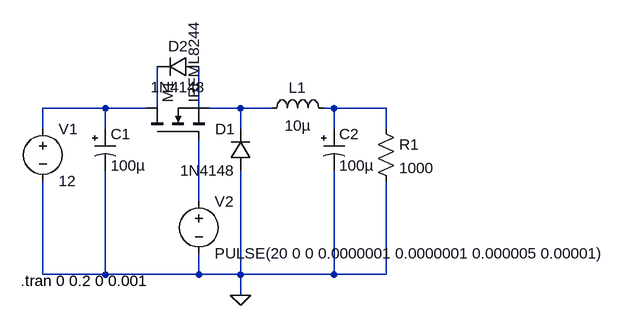
[diagram p0: schematic main.asc]
main.asc, the LTspice schematic file:
Version 4
SHEET 1 996 680
WIRE 96 96 0 96
WIRE 160 96 96 96
WIRE 176 96 176 32
WIRE 240 96 240 32
WIRE 304 96 256 96
WIRE 352 96 304 96
WIRE 448 96 432 96
WIRE 528 96 448 96
WIRE 0 128 0 96
WIRE 96 128 96 96
WIRE 304 128 304 96
WIRE 448 128 448 96
WIRE 528 128 528 96
WIRE 240 240 240 144
WIRE 0 352 0 208
WIRE 96 352 96 192
WIRE 96 352 0 352
WIRE 240 352 240 320
WIRE 240 352 96 352
WIRE 304 352 304 192
WIRE 304 352 240 352
WIRE 448 352 448 192
WIRE 448 352 304 352
WIRE 528 352 528 208
WIRE 528 352 448 352
WIRE 304 384 304 352
FLAG 304 384 0
SYMBOL voltage 0 112 R0
WINDOW 123 0 0 Left 2
WINDOW 39 0 0 Left 2
SYMATTR InstName V1
SYMATTR Value 12
SYMBOL voltage 240 224 R0
WINDOW 123 0 0 Left 2
WINDOW 39 0 0 Left 2
SYMATTR InstName V2
SYMATTR Value PULSE(20 0 0 0.0000001 0.0000001 0.000005 0.00001)
SYMBOL nmos 160 144 R270
SYMATTR InstName M1
SYMATTR Value IRFML8244
SYMBOL polcap 80 128 R0
WINDOW 3 24 56 Left 2
SYMATTR InstName C1
SYMATTR Value 100µ
SYMATTR Description Capacitor
SYMATTR Type cap
SYMATTR SpiceLine V=10 Irms=110m Rser=1.8 Lser=0
SYMBOL polcap 432 128 R0
WINDOW 3 24 56 Left 2
SYMATTR InstName C2
SYMATTR Value 100µ
SYMATTR Description Capacitor
SYMATTR Type cap
SYMATTR SpiceLine V=25 Irms=145m Rser=0.62 Lser=0
SYMBOL diode 320 192 R180
WINDOW 0 24 64 Left 2
WINDOW 3 24 0 Left 2
SYMATTR InstName D1
SYMATTR Value 1N4148
SYMBOL ind 336 112 R270
WINDOW 0 32 56 VTop 2
WINDOW 3 5 56 VBottom 2
SYMATTR InstName L1
SYMATTR Value 10µ
SYMBOL res 512 112 R0
SYMATTR InstName R1
SYMATTR Value 1000
SYMBOL diode 240 16 R90
WINDOW 0 0 32 VBottom 2
WINDOW 3 32 32 VTop 2
SYMATTR InstName D2
SYMATTR Value 1N4148
TEXT -34 362 Left 2 !.tran 0 0.2 0 0.001

The netlist it stands for:
* main.asc
V1 N001 0 12
V2 N006 0 PULSE(20 0 0 0.0000001 0.0000001 0.000005 0.00001)
M1 N001 N006 N004 N004 IRFML8244
C1 N001 0 100µ V=10 Irms=110m Rser=1.8 Lser=0
C2 N005 0 100µ V=25 Irms=145m Rser=0.62 Lser=0
D1 0 N004 1N4148
L1 N004 N005 10µ
R1 N005 0 1000
D2 N003 N002 1N4148
.model D D
.lib standard.dio
.model NMOS NMOS
.model PMOS PMOS
.lib standard.mos
.tran 0 0.2 0 0.001
.backanno
.end